# EAGLE board Schematic (EAGLE 9.6.2)
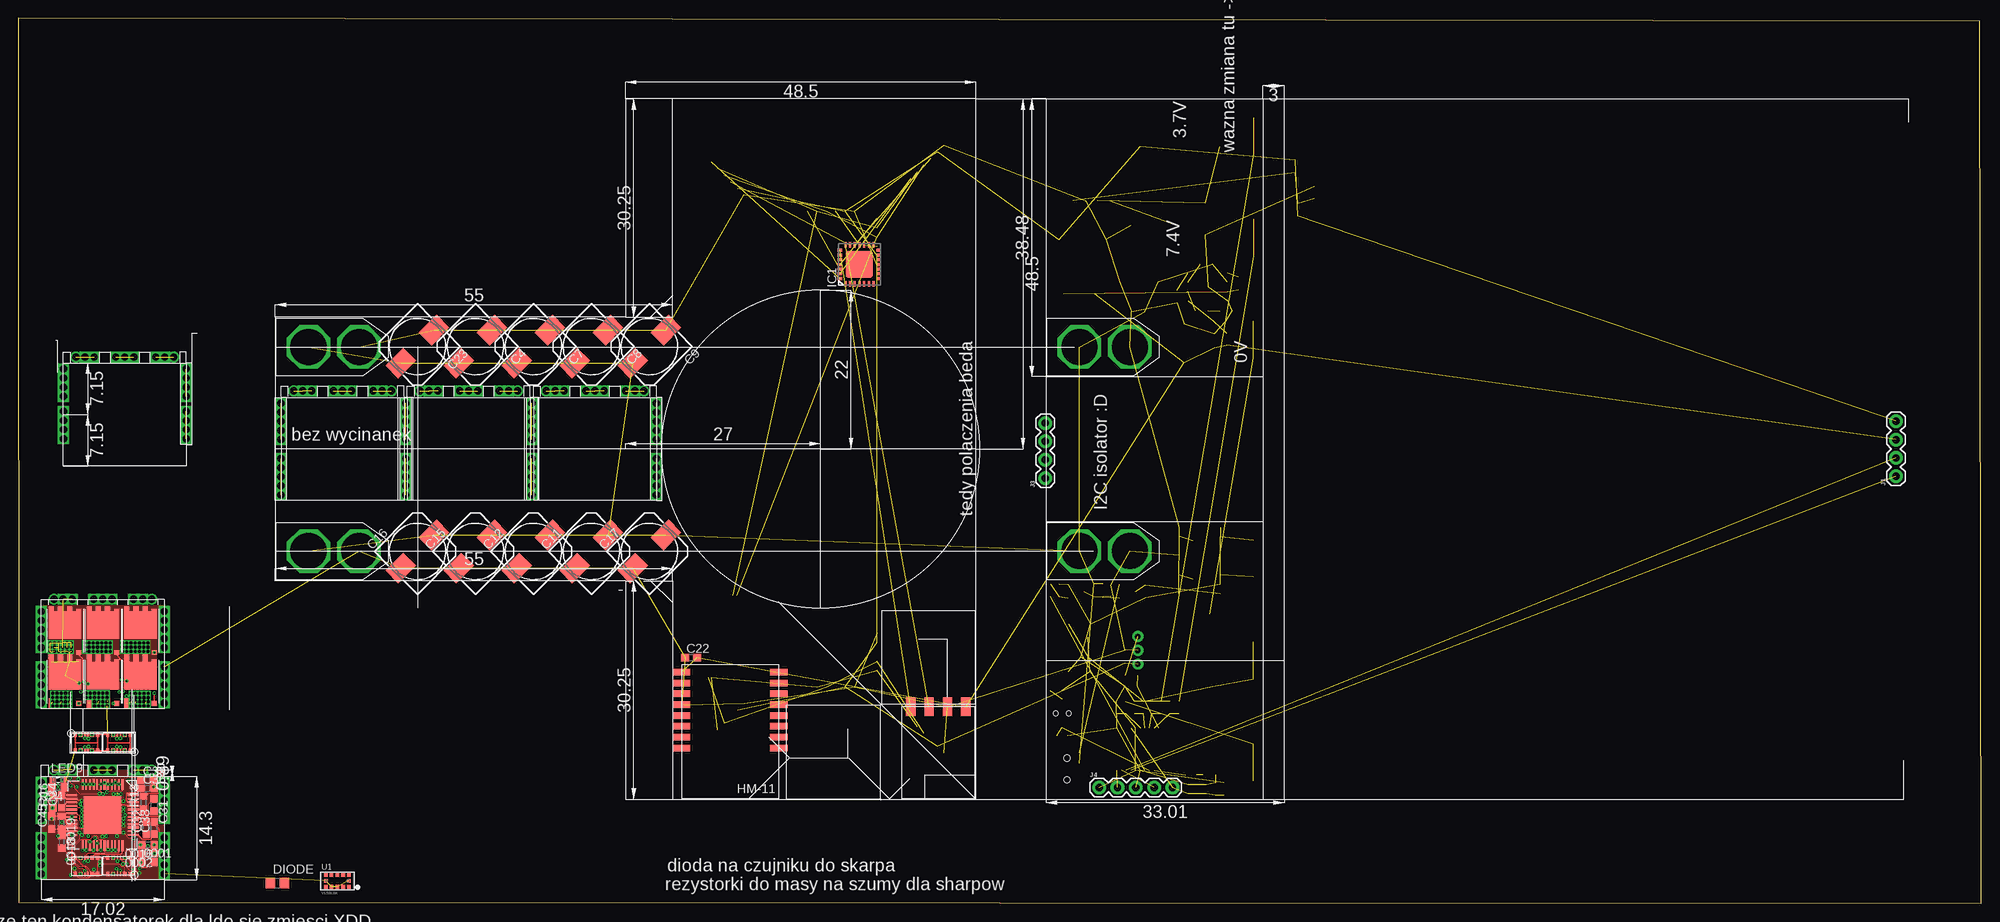
[diagram p6: board, top side]
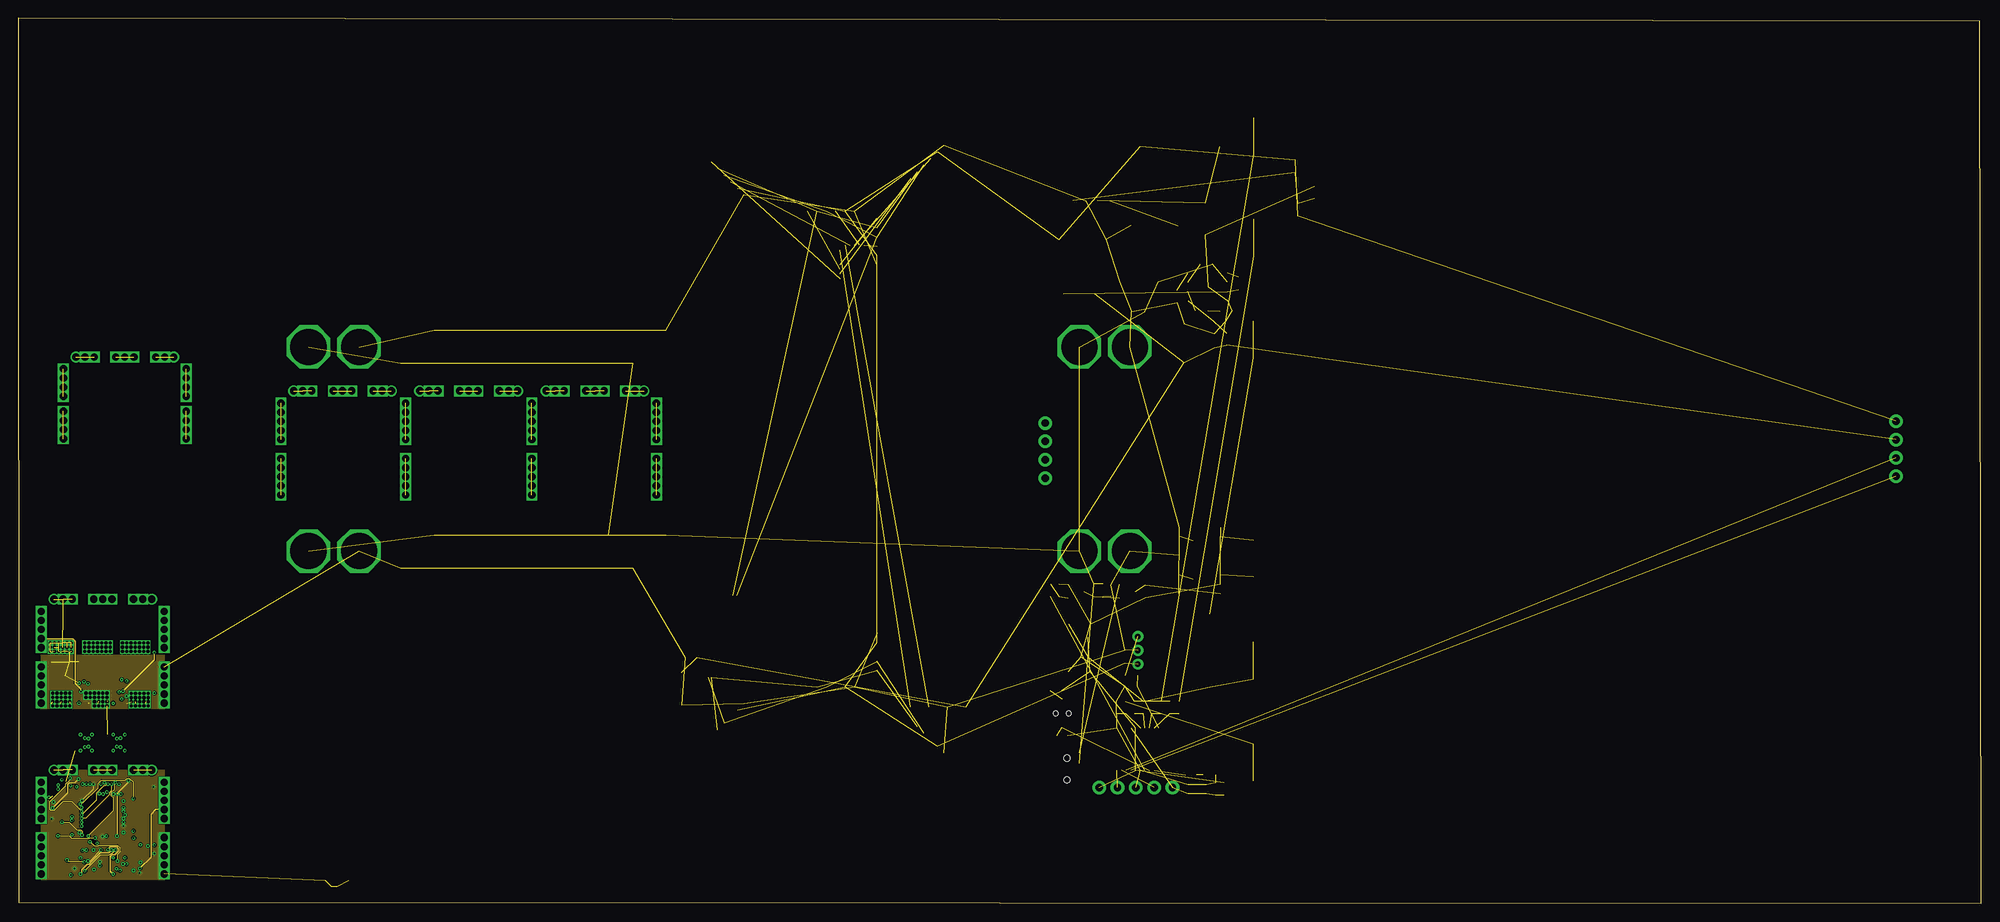
[diagram p7: board, inner layer Route2]
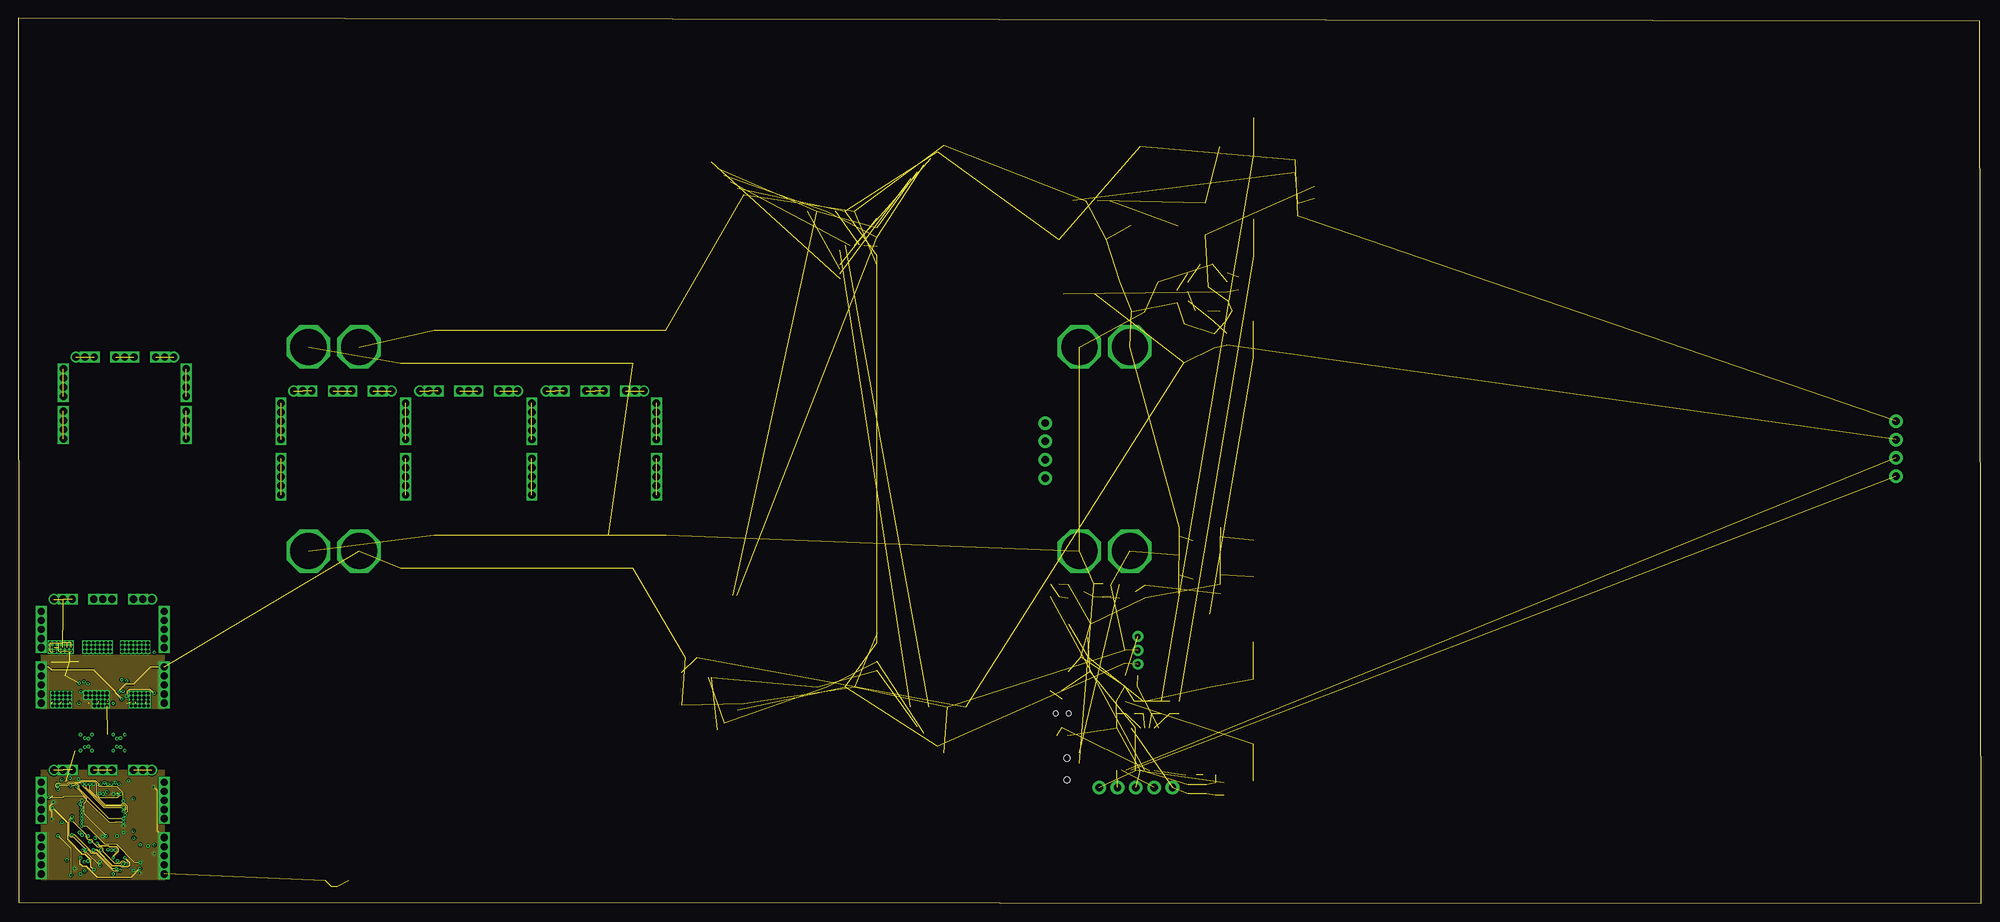
[diagram p8: board, inner layer Route15]
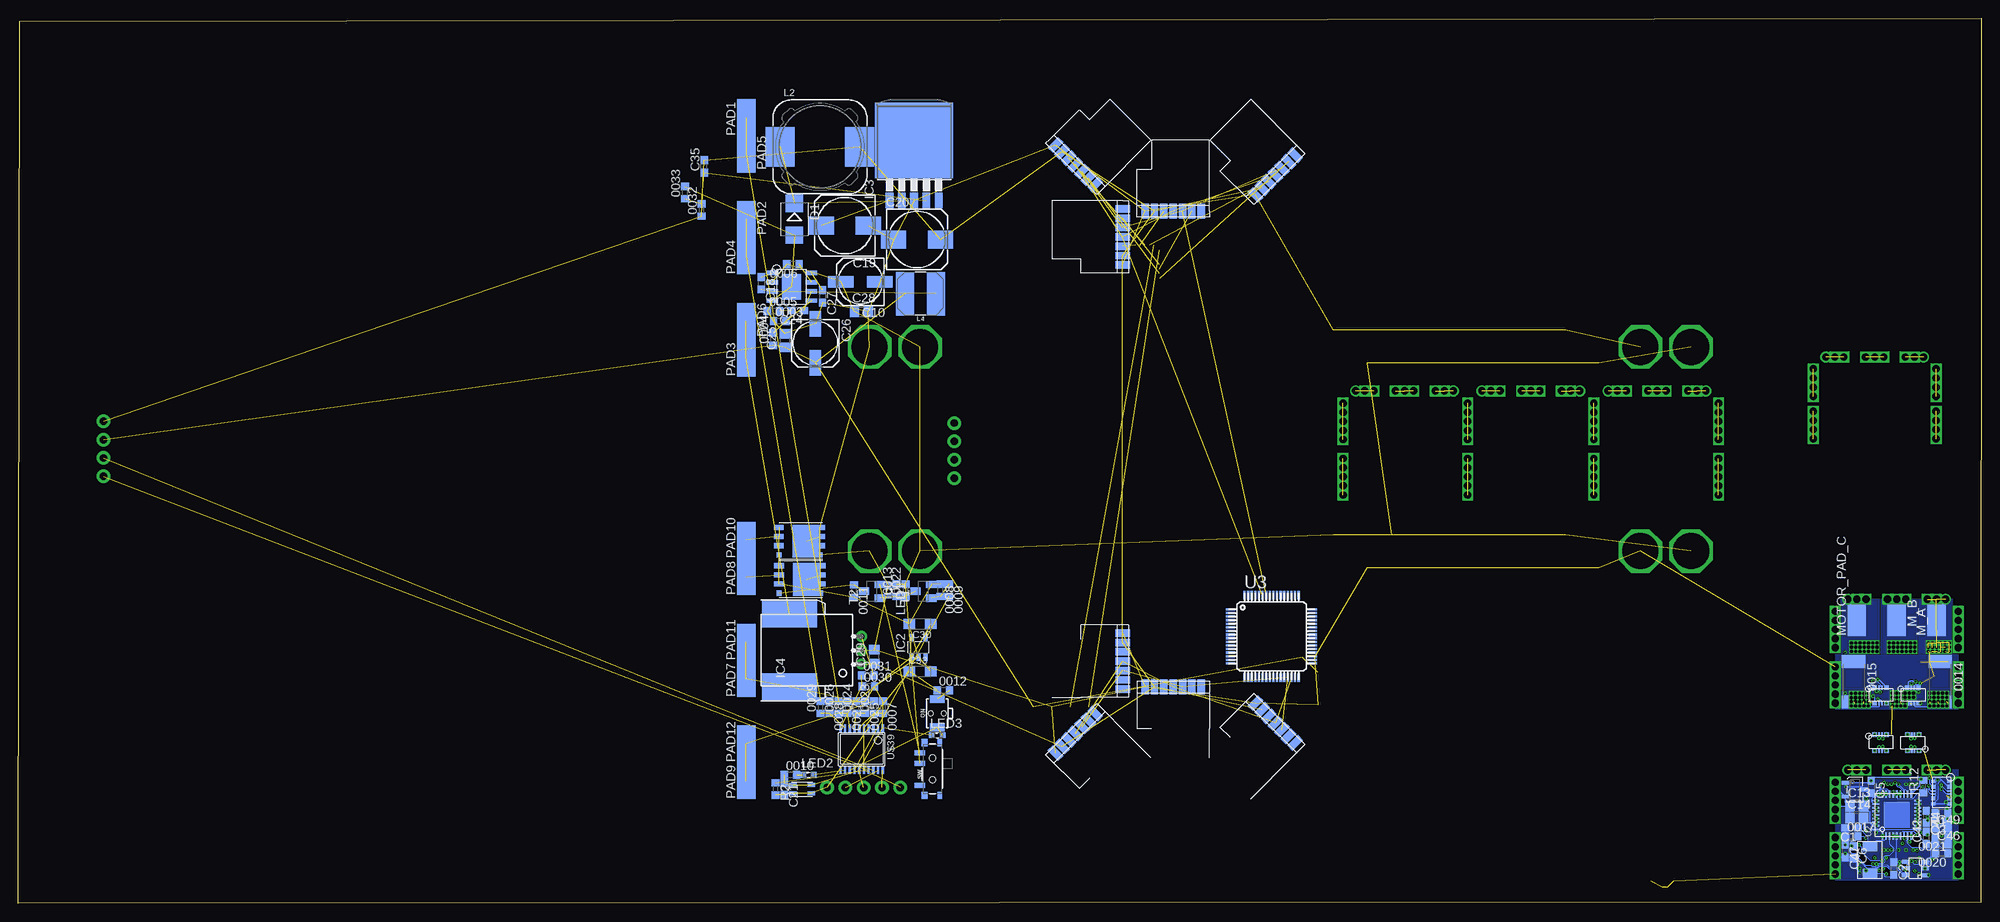
[diagram p9: board, bottom side, seen from below]

Size 271.79 x 122.61 mm. Coordinates in mm from the lower left corner, seen from the top.
Outline: 0.08,0.14 271.79,0 271.52,122.17 0,122.61 0.08,0.14
Copper layers (1*2*15*16): Top 0.035mm / dielectric 0.2mm / Route2 0.017mm / dielectric 0.2mm / Route15 0.017mm / dielectric 0.2mm / Bottom 0.035mm
Design rules "default *": minimum track width 5mil, minimum drill 0.3mm, track to track 3.5mil, track to pad 5mil, pad to pad 5mil, via to via 5mil, smd to smd 0mil, copper to edge 0mil, drill to drill 0mil, minimum pad ring 5mil, minimum via ring 5mil, stop-mask expansion 1mil, vias tented up to drill 0mil, thermal gap 0mil

## Footprints (pad centres in the part's own frame; a part is rotated, then mirrored left to right if it is on the bottom)
R0603 = smd 1 x 1.1: 1 -0.85,0; 2 0.85,0
R2512 = smd 1.8 x 3.2: 1 -2.8,0; 2 2.8,0
C0603 = smd 1.1 x 1: 1 -0.85,0; 2 0.85,0
153CLV-0810 = smd 3.5 x 2.5: + 3.25,0; - -3.25,0
153CLV-0605 = smd 3.5 x 1.6: + 2.7,0; - -2.7,0
C0805 = smd 1.3 x 1.5: 1 -0.95,0; 2 0.95,0
SMC_A = smd 1.6 x 1.4: + -1.5,0; - 1.5,0
SMB = smd 2.4 x 2.4: A 2.2,0; C -2.2,0
R0805 = smd 1.3 x 1.5: 1 -0.95,0; 2 0.95,0
QFN28-ML_6X6MM = smd 0.7 x 0.35: 1 -2.7,1.95; 2 -2.7,1.3; 3 -2.7,0.65; 4 -2.7,0; 5 -2.7,-0.65; 6 -2.7,-1.3; 7 -2.7,-1.95; 15 2.7,-1.95; 16 2.7,-1.3; 17 2.7,-0.65; 18 2.7,0; 19 2.7,0.65; 20 2.7,1.3; 21 2.7,1.95 | smd 0.35 x 0.7: 8 -1.95,-2.7; 9 -1.3,-2.7; 10 -0.65,-2.7; 11 0,-2.7; 12 0.65,-2.7; 13 1.3,-2.7; 14 1.95,-2.7; 22 1.95,2.7; 23 1.3,2.7; 24 0.65,2.7; 25 0,2.7; 26 -0.65,2.7; 27 -1.3,2.7; 28 -1.95,2.7 | smd 3.7 x 3.7: EXP 0,0
SOT23-5 = smd 0.6 x 1.05: 1 -0.95,-1.35; 2 0,-1.35; 3 0.95,-1.35; 4 0.95,1.35; 5 -0.95,1.35
TO263-5 = smd 1.067 x 2.159: 1 -3.404,-5.791; 2 -1.702,-5.791; 3 0,-5.791; 4 1.702,-5.791; 5 3.404,-5.791 | smd 10.8 x 10.41: 6 0,2.54
CB-PFF = drill 0.8 pad 1.5: 1 -1.91,-8.7; 2 0,-8.7; 3 1.91,-8.7 | smd 3.81 x 7.62: IP+ 5.08,1.27; IP- -5.08,1.27
1X04 = drill 1.016 pad 1.88: 1 0,0; 2 2.54,0; 3 5.08,0; 4 7.62,0
1X05 = drill 1.016 pad 1.88: 1 0,0; 2 2.54,0; 3 5.08,0; 4 7.62,0; 5 10.16,0
CDRH127/LD = smd 4 x 5.5: 1 -5.5,0; 2 5.5,0
SRN6045 = smd 2.5 x 6: 1 -2.175,0; 2 2.125,0
SML0603 = smd 0.8 x 0.8: A 0.75,0; C -0.75,0
SMD2,54-5,08 = smd 2.54 x 5.08: 1 0,0
TACTILE_SWITCH_SMD_RIGHT_ANGLE = smd 1.1 x 2: 1 -1.95,0; 2 1.95,0 | hole 0.7: 0,0.9; 0,-0.9
SWITCH_SPST_SMD_A = smd 0.7 x 1.5: 1 -2.25,-1.75; 2 -0.75,-1.75; 3 2.25,-1.75 | smd 1 x 0.6: GND1 -3.65,1; GND3 3.65,1 | smd 1 x 0.8: GND2 -3.65,-1.1; GND4 3.65,-1.1 | hole 0.9: -1.5,0; 1.5,0
SOT23-BEC = smd 1 x 1.4: B -0.95,-1.1; C 0,1.1; E 0.95,-1.1
LGA12_ST = smd 0.5 x 0.5: 1 1.6,-0.8; 2 0.8,-0.8; 3 0,-0.8; 4 -0.8,-0.8; 5 -1.6,-0.8; 6 -1.6,0; 7 -1.6,0.8; 8 -0.8,0.8; 9 0,0.8; 10 0.8,0.8; 11 1.6,0.8; 12 1.6,0
VFQFPN36-HS = smd 1 x 0.23: 1 -2.9,2; 2 -2.9,1.5; 3 -2.9,1; 4 -2.9,0.5; 5 -2.9,0; 6 -2.9,-0.5; 7 -2.9,-1; 8 -2.9,-1.5; 9 -2.9,-2; 19 2.9,-2; 20 2.9,-1.5; 21 2.9,-1; 22 2.9,-0.5; 23 2.9,0; 24 2.9,0.5; 25 2.9,1; 26 2.9,1.5; 27 2.9,2 | smd 0.23 x 1: 10 -2,-2.9; 11 -1.5,-2.9; 12 -1,-2.9; 13 -0.5,-2.9; 14 0,-2.9; 15 0.5,-2.9; 16 1,-2.9; 17 1.5,-2.9; 18 2,-2.9; 28 2,2.9; 29 1.5,2.9; 30 1,2.9; 31 0.5,2.9; 32 0,2.9; 33 -0.5,2.9; 34 -1,2.9; 35 -1.5,2.9; 36 -2,2.905
TQFP64 = smd 1.2 x 0.3: 1 -5.7,3.75; 2 -5.7,3.25; 3 -5.7,2.75; 4 -5.7,2.25; 5 -5.7,1.75; 6 -5.7,1.25; 7 -5.7,0.75; 8 -5.7,0.25; 9 -5.7,-0.25; 10 -5.7,-0.75; 11 -5.7,-1.25; 12 -5.7,-1.75; 13 -5.7,-2.25; 14 -5.7,-2.75; 15 -5.7,-3.25; 16 -5.7,-3.75; 33 5.7,-3.75; 34 5.7,-3.25; 35 5.7,-2.75; 36 5.7,-2.25; 37 5.7,-1.75; 38 5.7,-1.25; 39 5.7,-0.75; 40 5.7,-0.25; 41 5.7,0.25; 42 5.7,0.75; 43 5.7,1.25; 44 5.7,1.75; 45 5.7,2.25; 46 5.7,2.75; 47 5.7,3.25; 48 5.7,3.75 | smd 0.3 x 1.2: 17 -3.75,-5.7; 18 -3.25,-5.7; 19 -2.75,-5.7; 20 -2.25,-5.7; 21 -1.75,-5.7; 22 -1.25,-5.7; 23 -0.75,-5.7; 24 -0.25,-5.7; 25 0.25,-5.7; 26 0.75,-5.7; 27 1.25,-5.7; 28 1.75,-5.7; 29 2.25,-5.7; 30 2.75,-5.7; 31 3.25,-5.7; 32 3.75,-5.7; 49 3.75,5.7; 50 3.25,5.7; 51 2.75,5.7; 52 2.25,5.7; 53 1.75,5.7; 54 1.25,5.7; 55 0.75,5.7; 56 0.25,5.7; 57 -0.25,5.7; 58 -0.75,5.7; 59 -1.25,5.7; 60 -1.75,5.7; 61 -2.25,5.7; 62 -2.75,5.7; 63 -3.25,5.7; 64 -3.75,5.7
REC = smd 0.45 x 0.6: PAD_1 -0.75,0; PAD_2 2.35,0; PAD_3 -0.75,-2.25; PAD_4 2.35,-2.25 | smd 0.55 x 0.6: POWER_1 0,0; POWER_2 1.6,0; POWER_3 0,-2.25; POWER_4 1.6,-2.25 | smd 0.24 x 0.6: SIGNAL_1 0.6,0; SIGNAL_2 1,0; SIGNAL_3 0.6,-2.25; SIGNAL_4 1,-2.25
PLUG = smd 0.62 x 0.6: POWER_1 0,0; POWER_2 1.6,0; POWER_3 0,-2.2; POWER_4 1.6,-2.2 | smd 0.24 x 0.6: SIGNAL_1 0.6,0; SIGNAL_2 1,0; SIGNAL_3 0.6,-2.2; SIGNAL_4 1,-2.2
SMD_MINI = smd 1.3 x 2: 1 -1.85,0; 2 1.85,0
SOT-23-3 = smd 0.508 x 1.016: 1 -0.941,-1.312; 2 0.986,-1.312; 3 -0.03,1.282
Q5B = smd 3.8 x 4.52: D1 0,-0.635 | smd 0.686 x 0.71: D2 -1.905,1.27; G 3.81,1.27 | smd 1.372 x 0.71: D3 -1.905,0; D4 -1.905,-1.27; D5 -1.905,-2.54; S1 3.81,0; S2 3.81,-1.27; S3 3.81,-2.54
TOF+SHARP_V1 = smd 1.029 x 2.057: 5V 6.477,0; GND\ 7.772,0; GPIO 0,0; SCL 2.591,0; SDA 3.886,0; SHARP 5.182,0; XSHUT 1.295,0
XT60 = drill 5 octagon: + 4.5,0; - 11.5,0
TOF+SHARP_V2 = smd 1.029 x 2.057: 5V 1.295,0; GND\ 0,0; GPIO 7.772,0; SCL 5.182,0; SDA 3.886,0; SHARP 2.591,0; XSHUT 6.477,0
S-PQFP-G48 = smd 0.3 x 1.5: 1-EN_GATE 0,0; 2-INHA 0.5,0; 3-INLA 1,0; 4-INHB 1.5,0; 5-INLB 2,0; 6-INHC 2.5,0; 7-INLC 3,0; 8-NFAULT 3.5,0; 9-NSCS 4,0; 10-SDI 4.5,0; 11-SDO 5,0; 12-SCLK 5.5,0; 25-GL_C 5.5,8.5; 26-SL_C 5,8.5; 27-SH_C 4.5,8.5; 28_GH_C 4,8.5; 29-GH_B 3.5,8.5; 30-SH_B 3,8.5; 31-SL_B 2.5,8.5; 32-GL_B 2,8.5; 33-GL_A 1.5,8.5; 34-SL_A 1,8.5; 35-SH_A 0.5,8.5; 36-GH_A 0,8.5 | smd 1.5 x 0.3: 13-PWRGD 7,1.5; 14-GND1 7,2; 15-AVDD 7,2.5; 16-SO1 7,3; 17-SO2 7,3.5; 18-SO3 7,4; 19-SN3 7,4.5; 20-SP3 7,5; 21-SN2 7,5.5; 22-SP2 7,6; 23-SN1 7,6.5; 24-SP1 7,7; 37-VCP_LSD -1.5,7; 38-VCPH -1.5,6.5; 39-CP2H -1.5,6; 40-CP2L -1.5,5.5; 41-PVDD -1.5,5; 42-CP1L -1.5,4.5; 43-CP1H -1.5,4; 44-VDRAIN -1.5,3.5; 45-GND2 -1.5,3; 46-DVDD -1.5,2.5; 47-WAKE -1.5,2; 48-VREG -1.5,1.5 | smd 5.17 x 5.17: POWERPAD 2.75,4.25
SUPER_DUPER_GUZICZEK = smd 1 x 0.55: T1 0,0; T2 2.55,0; T3 0,-1.16; T4 2.55,-1.16
SOT-23 = smd 0.55 x 1: 1 0,0; 2 0.95,0; 3 1.9,0; 4 1.9,2.7; 5 0.95,2.7; 6 0,2.7
IR_SW = smd 2.54 x 1.27: GND 0,5.08; KILL 0,0; START 0,2.54; VCC 0,7.62
X2QFN = smd 0.25 x 0.53: ADDR 0,0; AIN_0 1.5,0; AIN_2 1.5,1.35; AIN_3 1,1.35; GND 1,0; NC 0.5,0; SDA 0,1.35; VDD 0.5,1.35 | smd 0.53 x 0.25: AIN_1 1.6,0.65; SCL -0.1,0.7
HM-11 = smd 2.4 x 0.9: GND 6.5,0; NC@5 -7,0; NC@6 -7,-1.5; NC@7 -7,-3; NC@8 -7,-4.5; NC@10 6.5,-3; PIO0 6.5,6; PIO1 6.5,4.5; PIO2 6.5,3; PIO3 6.5,1.5; RESETB 6.5,-1.5; UART_CTS -7,3; UART_RTS -7,6; UART_RX -7,1.5; UART_TX -7,4.5; VCC 6.5,-4.5
SOIC8N = smd 1.6 x 0.61: 1 5.41,0; 2 5.41,1.27; 3 5.41,2.54; 4 5.41,3.81; 5 0,3.81; 6 0,2.54; 7 0,1.27; 8 0,0 | smd 2.616 x 3.505: PAD 2.731,1.905
TSSOP20 = smd 0.305 x 0.991: 1 -2.925,-2.918; 2 -2.275,-2.918; 3 -1.625,-2.918; 4 -0.975,-2.918; 5 -0.325,-2.918; 6 0.325,-2.918; 7 0.975,-2.918; 8 1.625,-2.918; 9 2.275,-2.918; 10 2.925,-2.918; 11 2.925,2.918; 12 2.275,2.918; 13 1.625,2.918; 14 0.975,2.918; 15 0.325,2.918; 16 -0.325,2.918; 17 -0.975,2.918; 18 -1.625,2.918; 19 -2.275,2.918; 20 -2.925,2.918

## Placement (x,y rotation side)
0001  34.8kR  [R0603]  18.01,5.72 0 top
0002  4.99kR  [R0603]  18.01,6.92 180 top
0003  10k  [R0603]  166.34,80.65 0 bottom
0004  26.1k  [R0603]  167.27,78.16 90 bottom
0005  6.8k  [R0603]  167.21,82.04 0 bottom
0006  100k  [R0603]  164.52,88.53 180 bottom
0007  100k  [R0603]  152.06,27.17 270 bottom
0008  100k  [R0603]  144.12,43.37 270 bottom
0009  1k  [R0603]  142.89,43.37 270 bottom
0010  10k  [R0603]  164.87,17.82 0 bottom
0011  100k  [R0603]  156.07,43.24 270 bottom
0012  10k  [R0603]  143.69,29.53 0 bottom
0013  10k  [R0603]  150.18,43.37 90 bottom
0014  5mohm  [R2512]  5.71,30.73 270 bottom
0015  5mohm  [R2512]  17.7,30.73 270 bottom
0016  34.8kR  [R0603]  18.01,8.13 180 top
0017  4.99kR  [R0603]  17.97,9.32 0 bottom
0018  34.8kR  [R0603]  6.05,8.52 270 top
0019  4.99kR  [R0603]  6.05,11.21 270 top
0020  34.8kR  [R0603]  5.51,6.97 180 bottom
0021  4.99kR  [R0603]  5.51,9.17 180 bottom
0022  100k  [R0603]  148.95,43.37 90 bottom
0023  100k  [R0603]  153.29,27.17 90 bottom
0024  300k  [R0603]  155.75,27.17 90 bottom
0025  100k  [R0603]  154.52,27.17 270 bottom
0026  500k  [R0603]  158.22,27.17 90 bottom
0027  100k  [R0603]  156.98,27.17 270 bottom
0028  100k  [R0603]  159.45,27.17 270 bottom
0029  700k  [R0603]  160.68,27.17 90 bottom
0030  10k  [R0603]  154.08,30.05 0 bottom
0031  10k  [R0603]  154.15,31.6 0 bottom
0032  ?  [R0603]  177.16,96.02 90 bottom
0033  ?  [R0603]  179.48,98.44 90 bottom
C1  22pF  [C0603]  17.97,10.48 180 bottom
C2  22pF  [C0603]  12.13,4.85 270 bottom
C3  100nF  [C0603]  5.51,11.43 180 bottom
C4  [153CLV-0810]  63.31,77.11 225 top
C5  100nF  [C0603]  15.27,16.14 270 bottom
C6  0.1uf  [C0603]  17.75,7.1 270 bottom
C7  [153CLV-0810]  71.34,77.11 225 top
C8  [153CLV-0810]  79.36,77.11 225 top
C9  [153CLV-0810]  87.39,77.11 225 top
C10  10uF  [153CLV-0605]  155.18,86.09 180 bottom
C11  [153CLV-0810]  79.36,48.74 45 top
C12  [153CLV-0810]  71.34,48.74 45 top
C13  4.7uF  [C0805]  17.26,13.44 0 bottom
C14  4.7uF  [C0805]  17.26,11.84 0 bottom
C15  [153CLV-0810]  63.31,48.74 45 top
C16  [153CLV-0810]  55.28,48.74 45 top
C17  [153CLV-0810]  87.39,48.74 45 top
C18  10nF  [C0603]  168.91,85.89 270 bottom
C19  [153CLV-0810]  157.34,93.87 180 bottom
C20  [153CLV-0810]  147.35,91.95 0 bottom
C21  10nF  [C0603]  165.72,15.88 270 bottom
C22  100nF  [C0603]  93.15,34.05 0 top
C23  [153CLV-0810]  55.28,77.11 225 top
C24  3.9nF  [C0603]  163.84,82.11 180 bottom
C25  22uF  [C0805]  165.61,77.94 90 bottom
C26  10uF  [153CLV-0605]  161.42,77.58 270 bottom
C27  100nF  [C0603]  160.43,84.06 270 bottom
C28  10uF  [C0805]  155.04,81.94 0 bottom
C29  10uF  [C0805]  153.25,34.19 90 bottom
C30  10uF/10V  [SMC_A]  146.93,38.7 180 bottom
C31  0.047uF  [C0603]  18.81,13.65 270 top
C32  0.047uF  [C0603]  17.75,10.46 90 top
C33  10uf/10V  [SMC_A]  146.91,32.16 0 bottom
C34  1uF  [C0603]  6.05,14.14 90 top
C35  [C0603]  176.8,102.06 90 bottom
C36  1uF  [C0603]  17.92,15.94 0 top
C38  1uF  [C0603]  18.86,10.46 90 top
C39  1uF  [C0603]  17.92,17.04 0 top
C42  1000pF  [C0603]  7.63,9.09 90 bottom
C44  1000pF  [C0603]  7.63,12 270 bottom
C45  0.1uf  [C0603]  4.65,11.2 90 top
C46  0.1uf  [C0603]  5.51,8.13 0 bottom
C47  0.1uf  [C0603]  18.86,7.26 270 bottom
C49  0.1uf  [C0603]  5.51,10.33 0 bottom
D1  [SMB]  164.31,94.75 270 bottom
DIODE  [R0805]  35.9,2.84 0 top
IC1  MCP23017ML  [QFN28-ML_6X6MM]  116.47,88.49 90 top
IC2  TPS70933DBV  [SOT23-5]  147.13,35.47 0 bottom
IC3  LM2596S  [TO263-5]  147.75,103.14 0 bottom
IC4  ACS758ECB-200B-PFF-T  [CB-PFF]  163.7,35.05 90 bottom
J1  [1X04]  259.94,59.16 90 top
J3  [1X04]  142.2,58.9 90 top
J4  [1X05]  149.64,16.07 0 top
L2  CDRH127/LD  [CDRH127/LD]  160.78,104.78 0 bottom
L4  100  [SRN6045]  146.89,84.43 180 bottom
LED1  Red  [SML0603]  151.26,43.37 270 bottom
LED2  Red  [SML0603]  162.38,17.82 0 bottom
LED3  Red  [SML0603]  144.54,23.32 0 bottom
LED9  Red  [SML0603]  5.54,17.13 0 top
M_A  [SMD2,54-5,08]  6.22,39.59 0 bottom
M_B  [SMD2,54-5,08]  11.73,39.59 180 bottom
MOTOR_PAD_C  [SMD2,54-5,08]  17.25,39.59 0 bottom
ON  Button  [TACTILE_SWITCH_SMD_RIGHT_ANGLE]  144.54,26.35 90 bottom
PAD1  [SMD2,54-5,08]  170.98,108.84 0 bottom
PAD2  [SMD2,54-5,08]  170.98,94.73 180 bottom
PAD3  [SMD2,54-5,08]  170.98,75.54 0 bottom
PAD4  [SMD2,54-5,08]  170.98,89.66 0 bottom
PAD5  [SMD2,54-5,08]  170.98,103.76 180 bottom
PAD6  [SMD2,54-5,08]  170.98,80.62 180 bottom
PAD7  [SMD2,54-5,08]  170.98,31.13 0 bottom
PAD8  [SMD2,54-5,08]  170.98,45.24 0 bottom
PAD9  [SMD2,54-5,08]  170.98,17.02 0 bottom
PAD10  [SMD2,54-5,08]  170.98,50.32 0 bottom
PAD11  [SMD2,54-5,08]  170.98,36.21 0 bottom
PAD12  [SMD2,54-5,08]  170.98,22.1 0 bottom
R1  180nH  [R0603]  5.51,12.59 180 bottom
R2  100k  [R0603]  166.9,15.88 270 bottom
R12  10k  [R0603]  8.08,16.19 90 bottom
R13  100R  [R0603]  17.36,13.98 90 top
R16  100K  [R0603]  4.78,14.07 90 top
R24  10k  [R0603]  5.54,16.08 180 top
SW  [SWITCH_SPST_SMD_A]  145.21,18.63 270 bottom
T1  [SOT23-BEC]  146.47,43.24 90 bottom
T2  [SOT23-BEC]  153.59,43.24 90 bottom
U1  VL53L0X  [LGA12_ST]  44.2,3.12 0 top
U2  STM32F10XTXU6HS  [VFQFPN36-HS]  11.71,12.26 90 bottom
U3  STM32F10XRXT6  [TQFP64]  98.26,36.98 0 bottom
U$1  MOLEG_REC_8X0.4MM  [REC]  14.77,21.16 180 top
U$2  MOLEG_REC_8X0.4MM  [REC]  4.42,16.17 270 bottom
U$3  MOLEX_PLUG_8X0.4MM  [PLUG]  10.3,29.91 0 bottom
U$4  MOLEG_REC_8X0.4MM  [REC]  14.77,4.08 180 top
U$5  MOLEG_REC_8X0.4MM  [REC]  8.65,23.41 0 top
U$6  MOLEX_PLUG_8X0.4MM  [PLUG]  14.77,29.91 0 bottom
U$7  MOLEX_PLUG_8X0.4MM  [PLUG]  14.77,23.38 0 bottom
U$8  MOLEX_PLUG_8X0.4MM  [PLUG]  8.65,21.18 180 bottom
U$9  MOLEG_REC_8X0.4MM  [REC]  8.65,6.32 0 top
U$10  OSC_8MHZ  [SMD_MINI]  15.44,6.01 90 bottom
U$11  TLV760XX  [SOT-23-3]  17.54,15.77 270 bottom
U$12  CSD17573Q5B  [Q5B]  162.62,44.23 180 bottom
U$13  CSD17573Q5B  [Q5B]  162.66,49.54 180 bottom
U$14  TOF+SHARP  [TOF+SHARP_V1]  118.87,96.19 270 bottom
U$15  TOF+SHARP  [TOF+SHARP_V1]  108,95.86 180 bottom
U$16  TOF+SHARP  [TOF+SHARP_V1]  122.68,99.53 135 bottom
U$17  XT60  [XT60]  142.41,48.79 0 top
U$18  TOF+SHARP  [TOF+SHARP_V1]  95,103.62 225 bottom
U$19  TOF-SHARP  [TOF+SHARP_V2]  118.87,37.44 270 bottom
U$20  TOF-SHARP  [TOF+SHARP_V2]  100.5,27.74 315 bottom
U$21  DRV8305  [S-PQFP-G48]  14.45,16.51 180 top
U$22  CSD17573Q5B  [Q5B]  12.37,38.57 270 top
U$23  CSD17573Q5B  [Q5B]  12.37,31.53 270 top
U$24  CSD17573Q5B  [Q5B]  7.15,38.57 270 top
U$25  CSD17573Q5B  [Q5B]  7.15,31.53 270 top
U$26  CSD17573Q5B  [Q5B]  17.59,38.57 270 top
U$27  TOF-SHARP  [TOF+SHARP_V2]  128.18,20.83 45 bottom
U$28  CSD17573Q5B  [Q5B]  17.59,31.53 270 top
U$29  TOF-SHARP  [TOF+SHARP_V2]  115.77,30 0 bottom
U$30  SUPER_DUPER_GUZICZEK  [SUPER_DUPER_GUZICZEK]  164.53,16.45 0 bottom
U$31  TPD4E001  [SOT-23]  7.81,3.9 90 bottom
U$32  IR_SW  [IR_SW]  123.57,27.25 270 top
U$33  TLA2024  [X2QFN]  -16.66,-1.93 0 top  (outside the outline)
U$34  HM-11  [HM-11]  98.32,27.53 180 top
U$35  MP2307  [SOIC8N]  161.98,87.3 180 bottom
U$36  XT60  [XT60]  35.7,77.06 0 top
U$37  XT60  [XT60]  142.41,77.06 0 top
U$38  XT60  [XT60]  35.7,48.79 0 top
U$39  STM32F030F4  [TSSOP20]  155.02,21.37 180 bottom

## Tracks (layer width: path | path; a pad name or v marks a point on that pad's centre or on a via)
3.7V  (2 unrouted)
3V3  (7 unrouted)
3V3_L0  (6 unrouted)
5V  (14 unrouted)
7.4V+  (5 unrouted)
7.4V-  (2 unrouted)
11.1V  (2 unrouted)
14.8V  (2 unrouted)
+3V3  (via drill 0.2)  (1 unrouted)
  Top 0.203: C39.1 15.32,17.04 C5.1
  Route2 0.089: 13.86,15.31
  Route2 0.203: U2.1 v13.71,15.16 13.8,15.25 13.8,15.33 15.27,16.8 C5.1 | R16.1 6.87,15.31 6.87,16.47 7.11,16.72 7.15,16.72 7.86,16.72 v8.38,17.23
  Route15 0.203: v10.51,4.7 10.09,5.12 10.09,6.05 9.33,6.81 8.89,6.81 6.85,8.86 6.85,11.15 R16.1
  Bottom 0.089: U$31.5 v10.51,4.7 | U2.27 v13.71,15.16 | v13.71,15.16 | R1.1 4.66,13.11 R16.1
  Bottom 0.152: 9.66,15.16 U2.19
  Bottom 0.203: C5.1 15.13,17.13 15.13,17.14 | C5.1 15.32,16.93 | C5.1 15.27,16.87 | C5.1 15.54,16.71 U$11.1 | C5.1 14.82,17.44 8.48,17.44 8.34,17.3 8.33,17.3 R12.2 8.06,17.03 | U2.19 8.53,16.34 8.53,16.56 8.15,16.94 | 8.06,17.03 8.15,16.94 | R1.1 5.13,12.12 5.29,12.12 5.4,12.01 5.4,11.07 6.15,10.32 C49.1 | 7.79,17.35 7.79,17.3 8.06,17.03 | v8.38,17.23 8.38,17.17 8.15,16.94
  other vias: 13.71,9.36 15.27,16.99 4.78,13.22
A3.7  (2 unrouted)
A7.4  (2 unrouted)
A11.1  (2 unrouted)
A14.8  (2 unrouted)
ACURR  (2 unrouted)
BAT-  (26 unrouted)
BS  (1 unrouted)
BUTTON_L0  (2 unrouted)
COMP  (1 unrouted)
CURR  (1 unrouted)
EN  (1 unrouted)
ENGATE  (via drill 0.2)
  Top 0.089: U$21.1-EN_GATE 14.45,15.56 12.61,15.56 12.5,15.44 v12.28,15.44
  Bottom 0.089: U2.24 | U2.24 12.21,15.37 v12.28,15.44
FB  (2 unrouted)
GH_ABOT_3
  Top 0.203: U$9.POWER_2 10.25,6.37 10.7,6.81 12.11,6.81 12.12,6.82 14.22,6.82 14.45,7.05 U$21.36-GH_A
GH_ATOP_2  (via drill 0.2)
  Top 0.203: U$24.G 8.42,34.41 8.97,33.86 8.97,30.87 v9.13,30.7
  Bottom 0.203: v9.13,30.7 9.39,30.7 9.52,30.83 9.86,30.83 10.11,30.59 10.11,30.1 U$3.POWER_1
GH_BBOT_3  (via drill 0.2)
  Top 0.203: v10.95,8.34 U$21.29-GH_B
  Route15 0.203: U$4.POWER_4 13.17,6.53 13.88,7.24 13.88,7.59 13.63,7.83 12.66,7.83 12.49,8.01 11.29,8.01 v10.95,8.34
  other vias: 13.17,6.33
GH_BTOP_2  (via drill 0.2)
  Top 0.203: U$22.G 13.64,34.41 14.35,33.7 v14.35,30.99
  Bottom 0.203: v14.35,30.99 14.23,30.87 14.04,30.87 13.46,30.29 13.46,30.2 U$6.POWER_2
GH_CBOT_3  (via drill 0.2)
  Top 0.203: U$21.28_GH_C v10.45,7.41 | v10.45,7.41
  Route15 0.203: v10.45,7.41 10.87,7.41 13.02,5.26 14.16,5.26 14.35,5.06 15.19,5.06 15.45,5.32 15.45,5.66 14.79,6.33 U$4.POWER_3
  other vias: 14.77,6.33
GH_CTOP_1  (via drill 0.2)
  Route2 0.203: U$26.G 18.86,33.73 v14.51,29.38
  Bottom 0.203: v14.51,29.38 14.51,29.64 U$6.POWER_1
  other vias: 18.86,34.76
GL_ABOT_3  (via drill 0.2)
  Top 0.203: U$21.33-GL_A v12.95,7.41
  Route2 0.203: 12.95,7.37 v12.95,7.41 12.87,7.33 12.87,7.28 12.58,6.99 11.37,6.99 10.09,5.71 9.84,5.46 9.58,5.46 8.81,4.69 8.81,4.23 U$9.POWER_3
  other vias: 8.65,4.07
GL_ATOP_2  (via drill 0.2)
  Bottom 0.203: U$3.POWER_4 8.68,27.72 U$25.G
  other vias: 8.42,27.72
GL_BBOT_3  (via drill 0.2)
  Top 0.203: U$21.32-GL_B v12.45,7.45
  Route2 0.203: v12.45,7.45 12.54,7.54 12.54,7.59 12.78,7.83 13.63,7.83 13.88,7.59 13.88,7.24 13.38,6.74 13,6.74 12.75,6.5 12.75,4.49 U$4.POWER_2
  other vias: 13.17,4.08
GL_BTOP_2  (via drill 0.2)
  Top 0.203: U$6.POWER_4 13.19,27.72 U$23.G
  other vias: 13.17,27.71
GL_CBOT_3  (via drill 0.2)
  Top 0.089: U$21.25-GL_C 8.94,7.99 8.94,7.98 v8.94,7.35 | U$4.POWER_1 14.77,4.98 14.63,5.12 14.38,5.12 14.08,5.41 11.46,5.41 v11.31,5.27
  Route15 0.089: v8.94,7.35 9,7.35 9.3,7.05 9.53,7.05 v11.31,5.27
GL_CTOP_1  (via drill 0.2)
  Top 0.203: U$28.G v18.86,29.15
  Route15 0.203: v18.86,29.15 18.8,29.09 18.57,29.32 18.57,29.34 18.24,29.67 15.44,29.67 15.11,29.34 15.11,28.81 v15.02,28.73
  Bottom 0.203: U$6.POWER_3 14.77,28.48 v15.02,28.73
GND  (via drill 0.2, 0.45, 1)  (62 unrouted)
  Top 0.089: v14.61,10.75 14.12,10.75 13.94,10.92 12.55,10.92 12.38,11.09 | U$21.POWERPAD 11.7,11.77 12.38,11.09 | v11.7,9.28 11.7,10.52 | 11.7,10.52 11.7,10.57 11.8,10.67 11.96,10.67 12.38,11.09 | U$21.45-GND2 15.79,13.51 14.86,13.51 14.76,13.62 13.96,13.62 13.08,13.62 11.73,12.26 U$21.POWERPAD | U$21.14-GND1 7.48,14.54 7.53,14.54 8.04,14.54 8.31,14.27 v8.82,14.27 10.07,14.27 10.11,14.31 11.7,12.72 U$21.POWERPAD | U$21.9-NSCS | U2.26 13.21,14.47 11.7,12.96 11.7,11.89 | U$21.21-SN2 U$21.22-SP2 8.52,10.51 8.65,10.38 8.95,10.38 9.09,10.52 11.7,10.52 | 11.02,6.32 U$9.PAD_2 11,5.46 10.95,5.42 10.95,4.1 10.92,4.07 | 11.02,6.32 U$4.PAD_4 | U$4.PAD_2 U$9.PAD_4 10.92,4.07 | 10.92,4.07 U$9.POWER_4 | U$9.POWER_4 | U$9.PAD_3 8.24,3.73 8.24,3.72 8.32,3.64 9.82,3.64 U$9.POWER_4 | 16.35,4.43 16.14,4.22 15.66,4.22 U$4.PAD_1 | 16.35,4.43 16.35,4.73 15.52,5.56 U$4.PAD_3 | U$9.PAD_1 8.24,5.98 8.24,5.97 8.98,5.23 9.27,5.23 9.76,4.74 9.76,4.57 U$9.POWER_4 | 10.95,6.25 11.02,6.32 | v11.33,5.77 11.02,6.08 11.02,6.32 | 0002.1 19.01,7.07 | v16.84,4.24 16.54,4.24 16.35,4.43
  Top 0.203: U$5.PAD_1 7.9,22.28 | 7.9,22.28 U$5.PAD_3 | 11,22.28 U$5.PAD_2 U$1.PAD_4 12.42,22.25 | 11,22.28 U$5.PAD_4 | 11,22.28 7.9,22.28 | U$5.PAD_4 U$1.PAD_2 12.42,22.25 | U$1.PAD_3 15.52,22.25 | 15.52,22.25 U$1.PAD_1 | 12.42,22.25 15.52,22.25 | U$5.POWER_4 U$5.PAD_4 | C39.2 v18.77,16.14 C36.2 | 15.28,13.51 15.79,13.51 | U$21.45-GND2 15.85,13.62 14.84,13.62 14.78,13.67 14.44,13.67 14.38,13.62 13.96,13.62 | 19.29,10.88 C38.2 18.86,10.93 19.55,10.24 19.55,9.81 v20.24,9.12 | v4.65,11.72 C45.2 4.66,12.06 0019.1 6.51,11.6 6.51,11.28 6.78,11.01 U$21.21-SN2 | C34.2 5.52,14.46 5.52,14.34 5.21,14.04 v4.91,14.04 | C34.2 6.39,15.33 R24.1 | C34.2 6.49,14.54 7.53,14.54 | U$9.PAD_3 7.9,4.76 U$31.2 | 0002.1 19.93,6.92 v20.24,6.6
  Top 0.61: 12.36,28.04 U$23.S1 12.32,27.69 | 12.36,27.52 12.36,27.42 v12.32,27.38
  Route2 0.089: v8.82,14.27 10.46,15.9 U$21.9-NSCS
  Route15 0.203: v18.77,16.14 19.27,15.65 19.27,10.1 v20.24,9.12 | v4.65,11.72 4.65,12.76 4.36,13.05 4.36,13.48 v4.91,14.04
  Bottom 0.089: U2.36 14.61,10.53 | 14.61,10.53 v14.61,10.75 U2.35 | 14.61,10.53 v14.61,10.75 | v11.7,9.28 U2.5 11.71,7.67 11.82,7.56 11.82,6.01 C2.1 11.4,5.7 v11.33,5.77 | U2.18 v8.82,14.27 | 16.53,15.8 U$11.3 | C1.2 18.83,10.49 | 18.83,10.49 19.23,10.88 | 18.83,10.49 18.83,9.33 0017.1 19.11,9.61 | 0002.1 C47.2 17.92,6.41 C6.2 17.3,5.79 17.3,4.79 16.84,4.32 v16.84,4.24 | U$2.PAD_1 U$2.POWER_1 4.58,16.17 5.69,17.28 | 5.69,17.28 5.9,17.49 6.2,17.49 6.41,17.28 6.41,17.17 U$2.PAD_3 | 5.69,17.28 5.69,16.98 6.06,16.62 6.06,14.41 6.43,14.05 6.43,13.82
  Bottom 0.152: U$3.SIGNAL_3 U$3.POWER_3
  Bottom 0.203: U$8.POWER_2 U$5.POWER_4 | 15.63,15.18 15.57,15.2 15.47,15.29 C5.2 | v18.77,16.14 16.6,16.14 U$11.3 15.78,15.8 C5.2 | 15.57,15.77 15.57,15.6 C5.2 | U2.35 14.69,10.84 15.08,10.84 15.47,11.23 15.47,12.67 15.58,12.78 15.65,12.78 C13.2 16.31,14.27 16.37,14.33 16.37,14.68 16.13,14.92 15.63,14.92 C5.2 | C46.2 4.66,9.07 | 4.66,9.07 0021.1 C49.2 C3.1 4.66,11.71 v4.65,11.72 | U$2.PAD_2 4.69,13.82 v4.91,14.04 5.13,13.82 6.43,13.82 U$2.PAD_4 | v3.23,4.09 v3.23,5.35 v3.23,6.6 v3.23,7.86 v3.23,9.12 4.61,9.12 4.66,9.07 | v20.24,4.09 v20.24,5.35 v20.24,6.6 | v20.24,6.6 v20.24,7.86 v20.24,9.12 20.04,9.32 0017.1 | v20.24,6.6 20.05,6.41 C47.2
  other vias: 10.46,16.51 13.21,15.16 10.25,21.16 3.23,31.52 3.23,30.26 3.23,29.01 20.24,31.52 20.24,30.26 20.24,29.01 20.24,27.75 11.15,27.38 11.15,27.97 11.73,27.97 12.32,27.97 11.15,28.55 11.73,28.55 12.32,28.55 11.15,29.13 11.73,29.13 12.32,29.13 10.57,27.38 10.57,27.97 10.57,28.55 10.57,29.13 11.73,27.38 18.86,6.92 3.23,27.75 20.24,32.78 3.23,32.78 9.98,28.55 9.98,29.13 9.4,28.55 9.4,29.13 7.81,4.85
  pour Bottom (rank 2, no thermals): 3.23,26.95 3.23,34.39 20.24,34.39 20.24,26.95
  pour Route2 (no thermals): 3.23,34.39 20.24,34.39 20.24,26.95 3.23,26.95
  pour Route15 (no thermals): 3.23,34.39 20.24,34.39 20.24,26.95 3.23,26.95
  pour Top (no thermals): 3.23,3.3 3.23,18.48 7.47,18.48 20.24,18.48 20.24,3.85 20.24,3.3
  pour Route2 (no thermals): 3.23,3.3 3.23,18.48 17.25,18.48 20.24,18.48 20.24,3.9 20.24,3.3
  pour Route15 (no thermals): 3.23,3.3 3.23,18.48 17.51,18.48 20.24,18.48 20.24,3.43 20.24,3.3
  pour Bottom (no thermals): 3.23,3.3 3.23,18.48 17.49,18.48 20.24,18.48 20.24,3.87 20.24,3.3
GND1  (via drill 1)  (3 unrouted)
  other vias: -4.64,-19.33 -4.64,-20.6 -4.64,-21.87 -4.64,-23.14
GND2  (via drill 1)  (3 unrouted)
  other vias: 6.27,68.16 6.27,66.89 6.27,65.62 6.27,64.35
GND3  (via drill 1)  (3 unrouted)
  other vias: 23.29,68.16 23.29,66.89 23.29,65.62 23.29,64.35
GND4  (via drill 1)  (4 unrouted)
  other vias: 36.4,56.58 36.4,57.84 36.4,59.09 36.4,60.35 36.4,61.61
GND5  (via drill 1)  (3 unrouted)
  other vias: 12.38,-19.33 12.38,-20.6 12.38,-21.87 12.38,-23.14
GND6  (via drill 1)  (4 unrouted)
  other vias: 53.64,56.58 53.64,57.84 53.64,59.09 53.64,60.35 53.64,61.61
GND7  (via drill 1)  (4 unrouted)
  other vias: 71.12,56.58 71.12,57.84 71.12,59.09 71.12,60.35 71.12,61.61
GND8  (via drill 1)  (4 unrouted)
  other vias: 88.37,56.58 88.37,57.84 88.37,59.09 88.37,60.35 88.37,61.61
GND_A  (via drill 0.2)  (1 unrouted)
  Route15 0.203: 13.47,29.37 | 13.47,29.37 13.14,29.7 13.12,29.7 10.49,32.33 4.65,32.33 4.2,32.78 3.24,32.78 | v14.35,28.32 13.47,29.21 13.47,29.37
  Bottom 0.089: U$6.SIGNAL_4
  Bottom 0.203: U$6.SIGNAL_4 13.86,27.8 13.86,28.09 13.97,28.2 14.23,28.2 v14.35,28.32
GND_C  (via drill 0.2)  (1 unrouted)
  Route15 0.203: v14,29.29 14.09,29.38 14.09,29.55 14.94,30.4 15.99,30.4 18.36,32.78 19.27,32.78 | 19.27,32.78 20.23,32.78
  Bottom 0.203: U$6.SIGNAL_1 14.17,29.63 14.09,29.55 14.09,29.38 v14,29.29
INH_A  (via drill 0.2)
  Bottom 0.089: 14.17,13.76 U2.29 14.91,13.76 15.21,14.05 15.24,14.09 15.24,14.43 15.06,14.61 14.71,14.61 14.63,14.69 14.63,15.29 13.95,15.97 U$21.2-INHA
  other vias: 13.95,16.51
INH_B  (via drill 0.2)
  Top 0.089: U$21.4-INHB
  Route2 0.089: v8.8,11.75 8.95,11.89 9.46,11.89 12.67,15.11 12.67,15.38 12.96,15.66 U$21.4-INHB
  Bottom 0.089: U2.13 v8.8,11.75
  other vias: 12.96,16.51
INH_C  (via drill 0.2)
  Top 0.089: U$21.6-INHC v11.95,16.72
  Bottom 0.089: v11.95,16.72 11.81,16.58 11.81,16.36 11.6,16.15 11.34,16.15 11.03,15.84 10.81,15.61 10.72,15.61 10.71,15.6 U2.21
INL_A  (via drill 0.2)
  Top 0.089: v13.46,16.73 U$21.3-INLA
  Route2 0.089: v13.46,16.73 13.32,16.59 13.32,15.77 12.85,15.3 12.85,15.01 13.16,14.7 13.16,12.81 U2.9
  Bottom 0.089: U2.9
  other vias: 9.71,9.36
INL_B  (via drill 0.2)
  Route2 0.089: 12.45,16.41 12.45,16.45 | 12.45,16.45 U$21.5-INLB | U2.14 10.9,14.36 10.9,15.36 11.91,16.36 12.1,16.36 12.19,16.45 12.45,16.45
  Bottom 0.089: U2.14
  other vias: 8.8,12.26 12.45,16.51
INL_C  (via drill 0.2)
  Bottom 0.089: U$21.7-INLC 10.73,15.79 10.54,15.79 10.21,15.46 U2.20
  other vias: 11.45,16.51
INPUT  (via drill 0.2)
  Route2 0.089: v8.8,12.76 7.47,14.09 6.15,14.09 4.92,12.86 4.63,12.86 4.42,13.07 4.42,14.05 6.63,16.27 6.63,16.57 7.21,17.15 v7.21,17.35
  Bottom 0.089: v8.8,12.76 U2.15 | U$2.POWER_3 6.93,16.42 6.93,16.45 7.21,16.73 v7.21,17.35
KILL  (1 unrouted)
LED  (via drill 0.2)
  Top 0.089: v6.05,17.13 LED9.A 6.92,17.13 7.39,16.66 7.44,16.66 7.76,16.34 7.76,16.01 8.55,15.21 v11.26,15.21
  Bottom 0.089: 11.18,15.44 11.21,15.41 U2.22 v11.26,15.21 | U$2.POWER_4 6.32,14.91 6.31,14.91 6.24,14.99 6.24,16.95 v6.05,17.13
LED_L0  (1 unrouted)
MOSFET  (1 unrouted)
N$1  (3 unrouted)
N$3  (via drill 0.2)
  Bottom 0.203: U$5.POWER_3 U$8.POWER_1
  other vias: 8.65,21.16
N$4  (via drill 0.2)
  Top 0.203: U$5.SIGNAL_3 v9.24,21.65
  Bottom 0.203: v9.24,21.65 U$8.SIGNAL_1
N$5  (via drill 0.2)
  Top 0.203: v9.75,21.74 9.75,21.16 U$5.SIGNAL_4
  Bottom 0.203: 9.75,21.56 | 9.75,21.56 v9.75,21.74 | U$8.SIGNAL_2 9.75,21.28 9.75,21.56
N$6  (2 unrouted)
N$7  (via drill 0.2)
  Top 0.203: U$7.POWER_1 U$1.POWER_3
  other vias: 14.77,23.38
N$8  (via drill 0.2)
  Top 0.203: v14.18,22.92 U$1.SIGNAL_3
  Bottom 0.203: U$7.SIGNAL_1 v14.18,22.92
N$9  (via drill 0.2)
  Top 0.203: U$1.SIGNAL_4 13.67,23.41 v13.67,22.82
  Bottom 0.203: v13.67,22.82 13.67,23 | 13.67,23 | 13.67,23 13.67,23.28 U$7.SIGNAL_2
N$10
  Top 0.152: U$21.46-DVDD
  Top 0.203: C36.1 16.48,15.35 15.12,15.35 14.96,15.19 14.96,14.52 arc90 15.51,13.98 U$21.46-DVDD
N$11  (via drill 0.2)
  Top 0.203: U$1.POWER_4 U$7.POWER_2
  other vias: 13.17,23.38
N$12
  Top 0.203: C34.1 6.77,14.01 U$21.15-AVDD
N$13
  Top 0.089: 16.48,9.51 U$21.37-VCP_LSD
  Top 0.203: 16.48,9.51 16.54,9.51 17.18,8.87 18.33,8.87 18.45,8.99 18.45,9.2 C38.1
N$14
  Top 0.089: C31.2 18.33,12.32 16.92,12.32 16.6,12 U$21.42-CP1L
N$15  (via drill 0.2)
  Top 0.203: U$5.POWER_1 U$8.POWER_3
  other vias: 8.65,23.38
N$16
  Top 0.089: C31.1 18.04,13.74 18.04,12.58 17.97,12.5 U$21.43-CP1H
N$17  (via drill 0.2)
  Top 0.203: v9.24,22.92 v9.25,22.92 U$5.SIGNAL_1
  Bottom 0.203: U$8.SIGNAL_3 v9.25,22.92 v9.24,22.92
N$18  (via drill 0.2)
  Top 0.203: U$5.SIGNAL_2 9.75,23.41 v9.75,22.83
  Bottom 0.203: v9.75,22.83 9.75,23 | 9.75,23 | 9.75,23 9.75,23.28 U$8.SIGNAL_4
N$19  (via drill 0.2)
  Top 0.203: U$8.POWER_4 U$5.POWER_2
  other vias: 10.25,23.38
N$20
  Top 0.089: C32.2 16.85,11.31 16.54,11.01 U$21.40-CP2L
N$21
  Top 0.089: C32.1 16.99,10.38 16.86,10.51 U$21.39-CP2H
N$22
  Top 0.089: 16.14,13.01 U$21.44-VDRAIN
  Top 0.203: R13.1 17.34,13.01 16.14,13.01
N$23  (via drill 0.2)
  Bottom 0.203: C14.2 16.31,10.37 U$21.38-VCPH
  other vias: 15.95,10.01
N$24
  Bottom 0.089: U2.2 13.21,8.98 13.47,8.72 14.58,8.72 U$10.2 15.64,8.05 15.64,9.18 16.93,10.48 C1.1
N$25  (via drill 0.2)
  Bottom 0.203: U$1.POWER_1 U$7.POWER_3
  other vias: 14.77,21.16
N$26  (via drill 0.2)
  Top 0.203: U$1.SIGNAL_1 v14.18,21.64
  Bottom 0.203: v14.18,21.64 U$7.SIGNAL_3
N$27  (via drill 0.2)
  Top 0.203: v13.67,21.74 13.67,21.16 U$1.SIGNAL_2
  Bottom 0.203: 13.67,21.56 | 13.67,21.56 v13.67,21.74 | U$7.SIGNAL_4 13.67,21.28 13.67,21.56
N$28  (via drill 0.2)
  Bottom 0.203: U$7.POWER_4 U$1.POWER_2
  other vias: 13.17,21.16
N$29  (2 unrouted)
N$30  (via drill 1)  (2 unrouted)
  other vias: -2.9,-11.82 -1.64,-11.82 -0.38,-11.82
N$31  (via drill 1)  (2 unrouted)
  other vias: 2.62,-11.82 3.87,-11.82 5.13,-11.82
N$32  (via drill 1)  (2 unrouted)
  other vias: 8.13,-11.82 9.39,-11.82 10.64,-11.82
N$33  (via drill 1)  (2 unrouted)
  other vias: 38.14,70.98 39.4,70.98 40.65,70.98
N$34  (1 unrouted)
N$35  (via drill 1)  (2 unrouted)
  other vias: 43.65,70.98 44.91,70.98 46.16,70.98
N$36  (via drill 1)  (2 unrouted)
  other vias: 8.01,75.67 9.27,75.67 10.53,75.67
N$37  (via drill 1)  (2 unrouted)
  other vias: 4.97,18.48 6.22,18.48 7.48,18.48
N$38  (via drill 1)  (2 unrouted)
  other vias: 13.53,75.67 14.78,75.67 16.04,75.67
N$39  (via drill 1)  (2 unrouted)
  other vias: 19.04,75.67 20.29,75.67 21.55,75.67
N$43  (via drill 1)  (2 unrouted)
  other vias: 10.48,18.48 11.73,18.48 12.99,18.48
N$45  (via drill 0.2)
  Route2 0.152: v6.09,11.25 7.1,11.25 8.13,10.22 8.65,10.22 8.88,9.99 8.88,9.66 8.86,9.65 v8.86,9.49
  Bottom 0.089: C3.2 6.18,11.25 v6.09,11.25
  Bottom 0.152: U2.6 11.21,9.7 10.89,10.02 9.42,10.02 9.38,9.98 9.35,9.98 v8.86,9.49
  Bottom 0.203: R1.2 C3.2
N$47  (via drill 1)  (2 unrouted)
  other vias: 15.99,18.48 17.25,18.48 18.5,18.48
N$52  (1 unrouted)
N$53  (via drill 0.2)
  Top 0.089: v14.52,5.48 15.42,4.58 v15.99,4.58
  Bottom 0.089: C2.2 12.17,4.04 | 12.17,4.04 12.56,4.44 | v14.52,5.48 14.48,5.52 13.6,5.52 13.39,5.73 13.39,6.03 13.53,6.17 13.53,6.48 13.32,6.69 12.7,6.69 12.09,7.3 12.09,7.6 12.71,8.22 U2.3 | v15.99,4.58 15.87,4.58 U$10.1 13.6,4.16 13.53,4.09 13.53,3.93 13.32,3.72 12.49,3.72 12.17,4.04
N$54  (1 unrouted)
N$81
  Top 0.089: LED9.C 4.79,16.18 R24.2
N$87  (1 unrouted)
N$89  (2 unrouted)
N$90  (via drill 1)  (2 unrouted)
  other vias: 49.16,70.98 50.42,70.98 51.68,70.98
N$91  (via drill 1)  (2 unrouted)
  other vias: 55.61,70.98 56.87,70.98 58.13,70.98
N$92  (via drill 1)  (2 unrouted)
  other vias: 61.13,70.98 62.38,70.98 63.64,70.98
N$93  (via drill 1)  (2 unrouted)
  other vias: 66.64,70.98 67.89,70.98 69.15,70.98
N$94  (via drill 1)  (2 unrouted)
  other vias: 73.09,70.98 74.35,70.98 75.6,70.98
N$95  (via drill 1)  (2 unrouted)
  other vias: 78.6,70.98 79.86,70.98 81.11,70.98
N$96  (via drill 1)  (2 unrouted)
  other vias: 84.11,70.98 85.37,70.98 86.63,70.98
NFAULT  (via drill 0.2)
  Top 0.089: 10.95,15.92 | 10.95,15.92 U$21.8-NFAULT | v11.78,15.16 11.63,15.31 11.63,15.36 11.36,15.63 11.25,15.63 10.95,15.92
  Bottom 0.089: U2.23 | U2.23 v11.78,15.16 | U2.23 11.71,14.6 11.63,14.52 9.54,14.52 8.72,15.34 R12.1
NRST  (via drill 0.2)  (1 unrouted)
  Route15 0.089: U2.4 9.16,12.4 9.16,13.85 9.36,14.05 9.36,14.49 9.05,14.81 6.4,14.81 6.2,14.61 4.64,14.61 4.55,14.7 v4.29,14.7
  Bottom 0.089: v4.29,14.7 v4.29,14.69 U$2.POWER_2
  other vias: 12.21,9.36
NRST_L0  (5 unrouted)
OUT  (2 unrouted)
PWRGD
  Top 0.089: 7.42,14.97 U$21.13-PWRGD
SAFE_SW  (1 unrouted)
SCL  (via drill 0.2)
  Route15 0.089: U2.33 12.6,11.76 8.48,15.88 8.48,16.31 8.27,16.52 7.97,16.52 7.75,16.3 v7.29,16.3
  Bottom 0.089: U2.33 | v7.29,16.3 7.29,16.04 7.22,15.97 7.22,15.8 6.98,15.57 U$2.SIGNAL_3
  other vias: 14.61,11.76
SCL_L  (4 unrouted)
SCL_L0  (1 unrouted)
SCL_R  (4 unrouted)
SCLK  (via drill 0.2)
  Top 0.089: v8.94,16.53 v8.94,16.52 U$21.12-SCLK
  Route15 0.089: U2.30 11.96,13.26 8.94,16.27 v8.94,16.53
  other vias: 14.61,13.26
SDA  (via drill 0.2)
  Route15 0.089: U2.34 13.45,11.26 | 13.45,11.25 13.45,11.26 | 13.45,11.26 12.6,11.26 9.54,14.31 9.54,14.57 8.12,15.99 v8.12,16.16
  Bottom 0.089: 6.65,15.14 U$2.SIGNAL_4 7.12,15.17 7.39,15.44 7.39,15.9 7.47,15.98 7.93,15.98 v8.12,16.16
  other vias: 14.61,11.26
SDA_L  (4 unrouted)
SDA_L0  (1 unrouted)
SDA_R  (4 unrouted)
SDI  (via drill 0.2)
  Route15 0.089: v14.83,12.26 14.83,12.46 15.15,12.78 15.15,13.48 14.83,13.79 14.39,13.79 14.2,13.61 12.1,13.61 9.95,15.76 U$21.10-SDI
  Bottom 0.089: U2.32 v14.83,12.26
  other vias: 9.95,16.51
SDO  (via drill 0.2)
  Top 0.089: v9.45,16.51 U$21.11-SDO
  Route15 0.089: v14.61,12.75 14.75,12.89 14.76,12.89 14.97,13.11 14.97,13.4 14.76,13.62 14.46,13.62 14.28,13.43 12.03,13.43 9.45,16.01 v9.45,16.51
  Bottom 0.089: U2.31 v14.61,12.75
SH_ABOT_3  (via drill 0.2)
  Top 0.089: U$21.35-SH_A 13.95,7.06 13.96,7.05 12.02,7.05 9.77,7.05 9.4,6.68 9.4,6.47 U$9.SIGNAL_1 9.25,5.86 v9.17,5.77 | v6.78,6.05 6.78,6.94 0018.2
  Route2 0.089: v9.17,5.77 7.05,5.77 v6.78,6.05
SH_ATOP_2  (via drill 0.2, 0.45, 1)  (30 unrouted)
  Top 0.089: v8.47,30.52 8.3,30.52
  Top 1.016: U$25.D1
  Bottom 0.089: U$3.SIGNAL_2 9.14,30.06 9.14,30.26 9.07,30.34 8.65,30.34 v8.47,30.52
  other vias: 5.03,35.48 4.45,35.48 4.45,34.9 5.03,34.9 5.61,35.48 5.61,34.9 6.2,35.48 6.2,34.9 6.78,34.9 6.78,35.48 7.37,35.48 7.37,34.9 5.03,36.07 4.45,36.07 5.61,36.07 6.2,36.07 6.78,36.07 7.37,36.07 4.97,42.14 6.22,42.14 7.48,42.14
  pour Bottom (no thermals): 3.95,34.61 3.95,42.14 8.72,42.14 8.72,34.61
  pour Top (no thermals): 8.78,29.63 8.78,36.4 5.87,36.4 4.1,36.4 4.1,34.63 4.1,29.63
SH_BBOT_3  (via drill 0.2)
  Top 0.089: 11.45,7.59 U$21.30-SH_B v11.45,7.41 v11.46,7.41 | v9.67,5.88 9.67,6.3 U$9.SIGNAL_2
  Route2 0.089: v11.46,7.41 9.93,5.88 v9.67,5.88
  Bottom 0.089: v9.67,5.88 9.53,5.74 9.53,5.62 9.29,5.39 7.26,5.39 7.14,5.51 7.14,6.2 0020.2
SH_BTOP_2  (via drill 0.2, 0.45, 1)
  Top 0.089: v9.69,30.42 9.84,30.57 | 11.63,30.57 11.74,30.67
  Bottom 0.089: U$3.SIGNAL_1 9.7,30.41 v9.69,30.42
  other vias: 9.25,34.9 9.25,35.48 9.83,35.48 10.41,35.48 11,35.48 11.58,35.48 12.17,35.48 12.75,35.48 12.75,34.9 9.83,34.9 10.41,34.9 11,34.9 11.58,34.9 12.17,34.9 9.25,36.07 9.83,36.07 10.41,36.07 11,36.07 11.58,36.07 12.17,36.07 12.75,36.07 10.48,42.14 11.73,42.14 12.99,42.14
  pour Bottom (no thermals): 8.9,34.61 8.9,42.14 13.94,42.14 13.94,34.61
  pour Top (rank 2, no thermals): 14,29.63 14,36.4 11.38,36.4 8.9,36.4 8.9,34.94 8.9,29.63
SH_CBOT_3  (via drill 0.2)
  Top 0.089: v13.75,5.88 13.77,5.9 U$4.SIGNAL_4 | v9.96,8.54 v9.95,8.54 U$21.27-SH_C | v16.94,8.13 0016.2
  Top 0.203: U$21.27-SH_C
  Route2 0.089: v13.75,5.88 13.75,6.78 14.11,7.14 14.11,7.68 13.73,8.06 11.19,8.06 11.1,7.98 10.52,7.98 v9.96,8.54
  Bottom 0.089: v16.94,8.13 16.58,7.77 16.58,7.15 15.31,5.88 v13.75,5.88
SH_CTOP_1  (via drill 0.2, 0.45, 1)
  Bottom 0.089: U$6.SIGNAL_2 13.92,30.05 13.92,30.27 14.28,30.63 14.85,30.63 v15.04,30.82
  other vias: 14.47,34.9 14.47,35.48 15.05,35.48 15.63,35.48 16.22,35.48 16.8,35.48 17.39,35.48 17.97,35.48 17.97,34.9 17.39,34.9 16.8,34.9 16.22,34.9 15.63,34.9 15.05,34.9 14.47,36.07 15.05,36.07 15.63,36.07 16.22,36.07 16.8,36.07 17.39,36.07 17.97,36.07 15.99,42.14 17.25,42.14 18.5,42.14
  pour Bottom (no thermals): 14.12,34.61 14.12,42.14 19.49,42.14 19.49,34.61
  pour Top (no thermals): 19.22,29.63 19.22,36.4 14.3,36.4 14.12,36.4 14.12,36.2 14.12,29.63
SHARP_1  (1 unrouted)
SHARP_2  (1 unrouted)
SHARP_3  (1 unrouted)
SHARP_4  (1 unrouted)
SL_ABOT_3  (via drill 0.2)
  Top 0.089: U$9.SIGNAL_3 9.23,4.1 v9.23,4.52 8.87,4.88 8.38,4.88 7.36,5.9 7.36,7.76 8.49,8.88 v8.49,9.82 8.3,10.01 U$21.23-SN1
  Top 0.203: U$21.34-SL_A v13.45,7.42 v13.46,7.41
  Route2 0.089: v13.46,7.41 13.31,7.27 13.31,7.26 13.03,6.98 12.9,6.98 12.68,6.76 11.47,6.76 10.32,5.61 9.94,5.23 v9.23,4.52
  Bottom 0.089: C42.1 8.49,9.1 v8.49,9.82
SL_ATOP_2  (via drill 0.45)  (4 unrouted)
  Top 0.61: v7.14,27.95 7.12,27.94 7.12,27.39
  Bottom 0.203: U$3.SIGNAL_4 9.3,27.43 9.09,27.22 5.56,27.22 0014.2
  other vias: 4.81,27.37 4.81,27.95 5.4,27.37 5.4,27.95 5.98,27.95 5.98,27.37 6.57,27.37 6.57,27.95 7.15,27.37 4.81,28.54 5.4,28.54 5.98,28.54 6.57,28.54 7.15,28.54 4.81,29.12 5.4,29.12 5.98,29.12 6.57,29.12 7.15,29.12
  pour Bottom (no thermals): 7.48,29.45 7.48,26.95 3.98,26.95 3.98,29.45
SL_BOT_3
  Top 0.089: U$9.SIGNAL_4 9.59,4.14 9.59,4.67 9.2,5.06 8.45,5.06 7.77,5.74 7.54,5.97 7.54,7.69 8.76,8.9 10,8.9 10.53,9.44 10.83,9.44 11.04,9.22 11.04,9.05 11.2,8.89 11.66,8.89 11.84,8.71 12.01,8.71 12.01,8.07 U$21.31-SL_B
SL_C_2<2  (via drill 0.2)
  Top 0.089: U$21.26-SL_C 9.45,8.6 9.44,8.61 v9.44,7.42 v9.45,7.41 | v7.45,12.01 U$21.19-SN3 6.86,12.01 | U$4.SIGNAL_1 14.17,4.54 v14.13,4.59
  Route2 0.089: U$21.19-SN3 v7.45,12.01
  Route15 0.089: v14.13,4.59 13.92,4.59 13.78,4.45 13.25,4.45 10.82,6.87 10.23,6.87 9.69,7.41 v9.45,7.41 7.71,9.15 7.3,9.15 7.08,9.37 7.08,11.66 7.29,11.87 7.31,11.87 v7.45,12.01
  Bottom 0.089: C44.1 7.45,12.67 v7.45,12.01
SL_CTOP_1  (via drill 0.45)  (3 unrouted)
  Bottom 0.203: U$6.SIGNAL_3 14.17,27.2 17.91,27.2 0015.2
  other vias: 15.67,27.94 16.26,27.94 16.84,27.94 17.42,27.94 18.01,27.94 17.42,27.36 18.01,27.36 16.26,27.36 16.84,27.36 15.67,27.36 15.67,28.52 16.26,28.52 16.84,28.52 17.42,28.52 18.01,28.52 15.67,29.11 16.26,29.11 16.84,29.11 17.42,29.11 18.01,29.11
  pour Bottom (no thermals): 15.34,29.44 19.49,29.44 19.49,28.3 19.49,26.95 15.41,26.95 15.34,26.95
SO1  (via drill 0.2)
  Top 0.089: v8.8,13.27 8.32,13.27 8.06,13.53 7.47,13.53 U$21.16-SO1
  Bottom 0.089: v8.8,13.27 U2.16
SO3  (via drill 0.2)
  Top 0.089: v8.8,11.25 8.66,11.39 8.65,11.39 8.44,11.6 8.44,12.11 8.04,12.51 U$21.18-SO3
  Bottom 0.089: v8.8,11.25 v8.81,11.25 U2.12
SP_ABOT_3  (via drill 0.2)
  Top 0.089: 13.75,4.05 U$4.SIGNAL_2 13.77,4.43 13.77,4.44 13.77,4.67 v13.63,4.81
  Route15 0.089: U$21.24-SP1 7.87,9.51 10.09,7.29 10.09,7.26 10.3,7.05 10.89,7.05 13.14,4.81 v13.63,4.81
  Bottom 0.089: C42.2 7.45,9.76 U$21.24-SP1
  other vias: 7.45,9.51
SP_CBOT_3  (via drill 0.2)
  Top 0.089: U$21.20-SP3 v7.44,11.51 | U$4.SIGNAL_3 14.36,6.13 14.36,5.97 14.49,5.84 14.67,5.84 v15.02,5.49 v15.03,5.49
  Route15 0.089: v15.03,5.49 v15.02,5.49 14.67,5.84 14.38,5.84 14.03,5.49 13.46,5.49 11.82,7.14 11.82,7.56 11.6,7.77 11.01,7.77 10.32,8.46 10.32,8.69 10.11,8.9 9.65,8.9 9.35,9.21 9.35,9.6 v7.44,11.51
  Bottom 0.089: C44.2 7.44,11.34 v7.44,11.51
SS  (1 unrouted)
START  (1 unrouted)
SW  (2 unrouted)
SWCLK  (via drill 0.2)
  Route15 0.089: v14.6,14.19 14.58,14.21 14.58,15.31 13.74,16.15 11.3,16.15 11.09,16.36 11.09,16.66 10.76,16.99 | v5.55,15.86 5.2,16.21 5.2,16.53 5.41,16.74 5.71,16.74 5.89,16.56 6.79,16.56 7.06,16.84 7.78,16.84 7.82,16.87 8.53,16.87 8.72,17.06 10.66,17.06 10.7,17.03 10.74,16.99 10.76,16.99 | 10.76,16.99
  Bottom 0.089: 14.54,14.19 U2.28 | U2.28 | U2.28 v14.6,14.19 | U2.28 | U2.28 v14.6,14.19 | v5.55,15.86 4.86,15.17 U$2.SIGNAL_2
SWCLK_L0  (1 unrouted)
SWDIO  (via drill 0.2)
  Route15 0.089: v14.22,15.16 14.07,15.02 14.07,15.01 13.71,14.64 11.32,14.64 10.82,15.15 10.82,16.66 10.59,16.89 8.79,16.89 8.6,16.7 7.89,16.7 7.86,16.66 7.14,16.66 6.86,16.38 v5.56,16.38
  Bottom 0.089: U2.25 12.85,15.29 12.85,15.6 13.04,15.79 13.88,15.79 14.07,15.59 14.07,15.31 v14.22,15.16 | v5.56,16.38 4.75,15.57 U$2.SIGNAL_1
SWDIO_L0  (1 unrouted)
VA  (via drill 0.2)
  Top 0.089: C45.1 4.66,10.36 0019.2 0018.1 v5.55,9.37
  Route2 0.089: v5.55,9.37 7.08,9.37 7.46,9 9.86,9 9.94,9.08 v10.68,9.08
  Route15 0.089: v5.55,9.37 7.3,7.61 v7.3,3.92
  Bottom 0.089: v10.68,9.08 10.71,9.11 U2.7 | v7.3,3.92 7.33,3.9 U$31.1
VB
  Bottom 0.089: U2.8 10.21,8.8 10.32,8.69 10.32,8.39 9.7,7.77 8.4,7.77 8.19,7.56 7.08,7.56 7.04,7.6 | 7.32,5.85 7.32,5.8 U$31.3 7.04,6.57 7.04,7.6 | 0020.1 5.18,7.49 5.27,7.49 5.9,8.13 C46.1 6.36,8.15 | 6.36,8.15 0021.2 | 6.36,8.15 6.74,7.77 6.87,7.77 7.04,7.6
VC  (via drill 0.2)
  Top 0.089: v14.6,9.82 15.07,9.36 15.07,9.3 15.33,9.04 v16.01,9.04 | 0016.1 C47.1
  Bottom 0.089: U2.10 13.81,10.26 14.06,10.01 14.42,10.01 v14.6,9.82 | U$31.4 9.97,5.26 9.96,5.26 9.88,5.18 9.88,4.52 10.09,4.31 10.93,4.31 11.64,5.02 12.68,5.02 13.01,5.34 14.15,5.34 14.38,5.12 14.67,5.12 14.69,5.13 15.18,5.13 15.35,5.3 16.05,5.3 17.12,6.38 17.12,6.85 17.2,6.93 17.98,6.93 18.39,7.34 18.39,7.64 C47.1 18.86,8.4 18.62,8.64 17.8,8.64 0017.2 16.28,9.32 v16.01,9.04
  other vias: 18.86,8.11
VIN  (20 unrouted)
VIN1  (1 unrouted)
VMOTOR  (via drill 0.2, 1)
  Top 0.089: 15.3,11.45 15.3,11.57 15.89,11.57 U$21.41-PVDD
  Top 0.203: R13.2 17.7,14.83 18.12,15.25 19.4,15.25 19.68,15.53 v20.24,15.53 | U$21.41-PVDD 16.11,11.67 16.78,11.67 17.17,12.06 19.28,12.06 | 19.39,12.06 19.28,12.06 | v16.85,4.85 16.98,4.97 17.74,4.97 18.48,5.71 0001.2 | 19.28,12.06 19.29,12.06 19.44,12.06 19.73,11.76 v20.24,11.76 v20.24,13.02 v20.24,14.27 v20.24,15.53 | v20.24,15.53 v20.24,16.79
  Route2 0.203: v16.85,4.85 18.4,6.4 18.4,12.37 19.05,13.02 v20.24,13.02
  Route15 0.203: U$9.POWER_1 8.65,6.1 8.57,6.02 8.57,5.53 8.92,5.18 9.44,5.18 10.96,3.66 15.66,3.66 v16.85,4.85
  Bottom 0.203: C13.1 18.85,14.08 U$11.2 19.6,15.53 v20.24,15.53 | C13.1 19.75,13.44 20.17,13.02 v20.24,13.02 | C14.1 C13.1
  other vias: 8.65,6.32
VMOTOR_TOP  (via drill 0.2, 1)
  Top 1.27: 6.52,38.56 U$24.D1 | 18.59,38.57 U$26.D1
  Route2 0.203: v8.7,29.32 8.7,29.7 7.93,30.47 7.93,36.3 7.6,36.63 3.27,36.63 v3.23,36.68
  Bottom 0.203: U$3.POWER_2 v8.7,29.32
  other vias: 3.23,40.45 3.23,39.19 3.23,37.93 20.24,40.45 20.24,39.19 20.24,37.93 20.24,36.68 3.23,35.42 20.24,35.42
  pour Top (rank 3, no thermals): 3.24,41.25 20.24,41.25 20.24,35 20.24,34.67 19.74,34.67 3.23,34.67 3.23,41.25
VMOTOR_TOP1  (via drill 1)
  Bottom 0.203: v3.23,11.76 v3.23,13.02 v3.23,14.27 v3.23,15.53 v3.23,16.79
VMOTOR_TOP2  (via drill 1)  (3 unrouted)
  other vias: 6.27,74.03 6.27,72.76 6.27,71.49 6.27,70.22
VMOTOR_TOP3  (via drill 1)  (3 unrouted)
  other vias: 23.29,74.03 23.29,72.76 23.29,71.49 23.29,70.22
VMOTOR_TOP4  (via drill 1)  (4 unrouted)
  other vias: 36.4,69.28 36.4,68.02 36.4,66.76 36.4,65.51 36.4,64.25
VMOTOR_TOP5  (via drill 1)  (4 unrouted)
  other vias: 53.64,69.28 53.64,68.02 53.64,66.76 53.64,65.51 53.64,64.25
VMOTOR_TOP6  (via drill 1)  (4 unrouted)
  other vias: 71.12,69.28 71.12,68.02 71.12,66.76 71.12,65.51 71.12,64.25
VMOTOR_TOP7  (via drill 1)  (4 unrouted)
  other vias: 88.37,69.28 88.37,68.02 88.37,66.76 88.37,65.51 88.37,64.25
VMOTOR_TOP8  (via drill 1)  (3 unrouted)
  other vias: -4.64,-13.46 -4.64,-14.73 -4.64,-16 -4.64,-17.27
VMOTOR_TOP9  (via drill 1)  (3 unrouted)
  other vias: 12.38,-13.46 12.38,-14.73 12.38,-16 12.38,-17.27
VV  (via drill 0.2)
  Top 0.089: v17.97,7.95 17.97,7.71 17.71,7.44 17.68,7.44 0002.2 0001.1 17.13,5.68 v16.94,5.68
  Route15 0.089: 13.55,8.24 13.56,8.24 | v8.8,10.74 9.52,10.74 12.02,8.24 12.58,8.24 12.59,8.24 13.56,8.24 | v16.94,5.68 16.11,5.68 13.56,8.24
  Bottom 0.089: 9.17,10.76 U2.11 v8.8,10.75 v8.8,10.74 | U$31.6 10.79,3.9 11.73,4.84 12.76,4.84 13.08,5.17 14.08,5.17 14.3,4.94 15.94,4.94 16.68,5.68 v16.94,5.68 | v17.97,7.95 C6.1
WAKE  (via drill 0.2)
  Top 0.089: U$21.47-WAKE
  Route2 0.089: v8.6,13.78 8.73,13.91 8.97,13.91 11.09,16.03 11.09,16.66 11.52,17.09 14.85,17.09 15.12,17.35 15.41,17.35 15.95,16.81 15.95,15.63 15.95,15.52 U$21.47-WAKE
  Bottom 0.089: U2.17 8.62,13.76 v8.6,13.78
  other vias: 15.95,14.51
XSHUT_1  (1 unrouted)
XSHUT_2  (1 unrouted)
XSHUT_3  (1 unrouted)
XSHUT_4  (1 unrouted)
(copper drawn outside any net)
  shapes: Top area x2

## Text on the board
tPlace: 3.7V | wazna zmiana tu -> | 7.4V | 0V | bez wycinanek | I2C isolator :D | tedy polaczenia beda | wazna zmiana tu -> | dioda na czujniku do skarpa | rezystorki do masy na szumy dla sharpow | moze ten kondensatorek dla ldo sie zmiesci XDD